# Altium schematic sheet H3_CPU_02.SchDoc
size A3
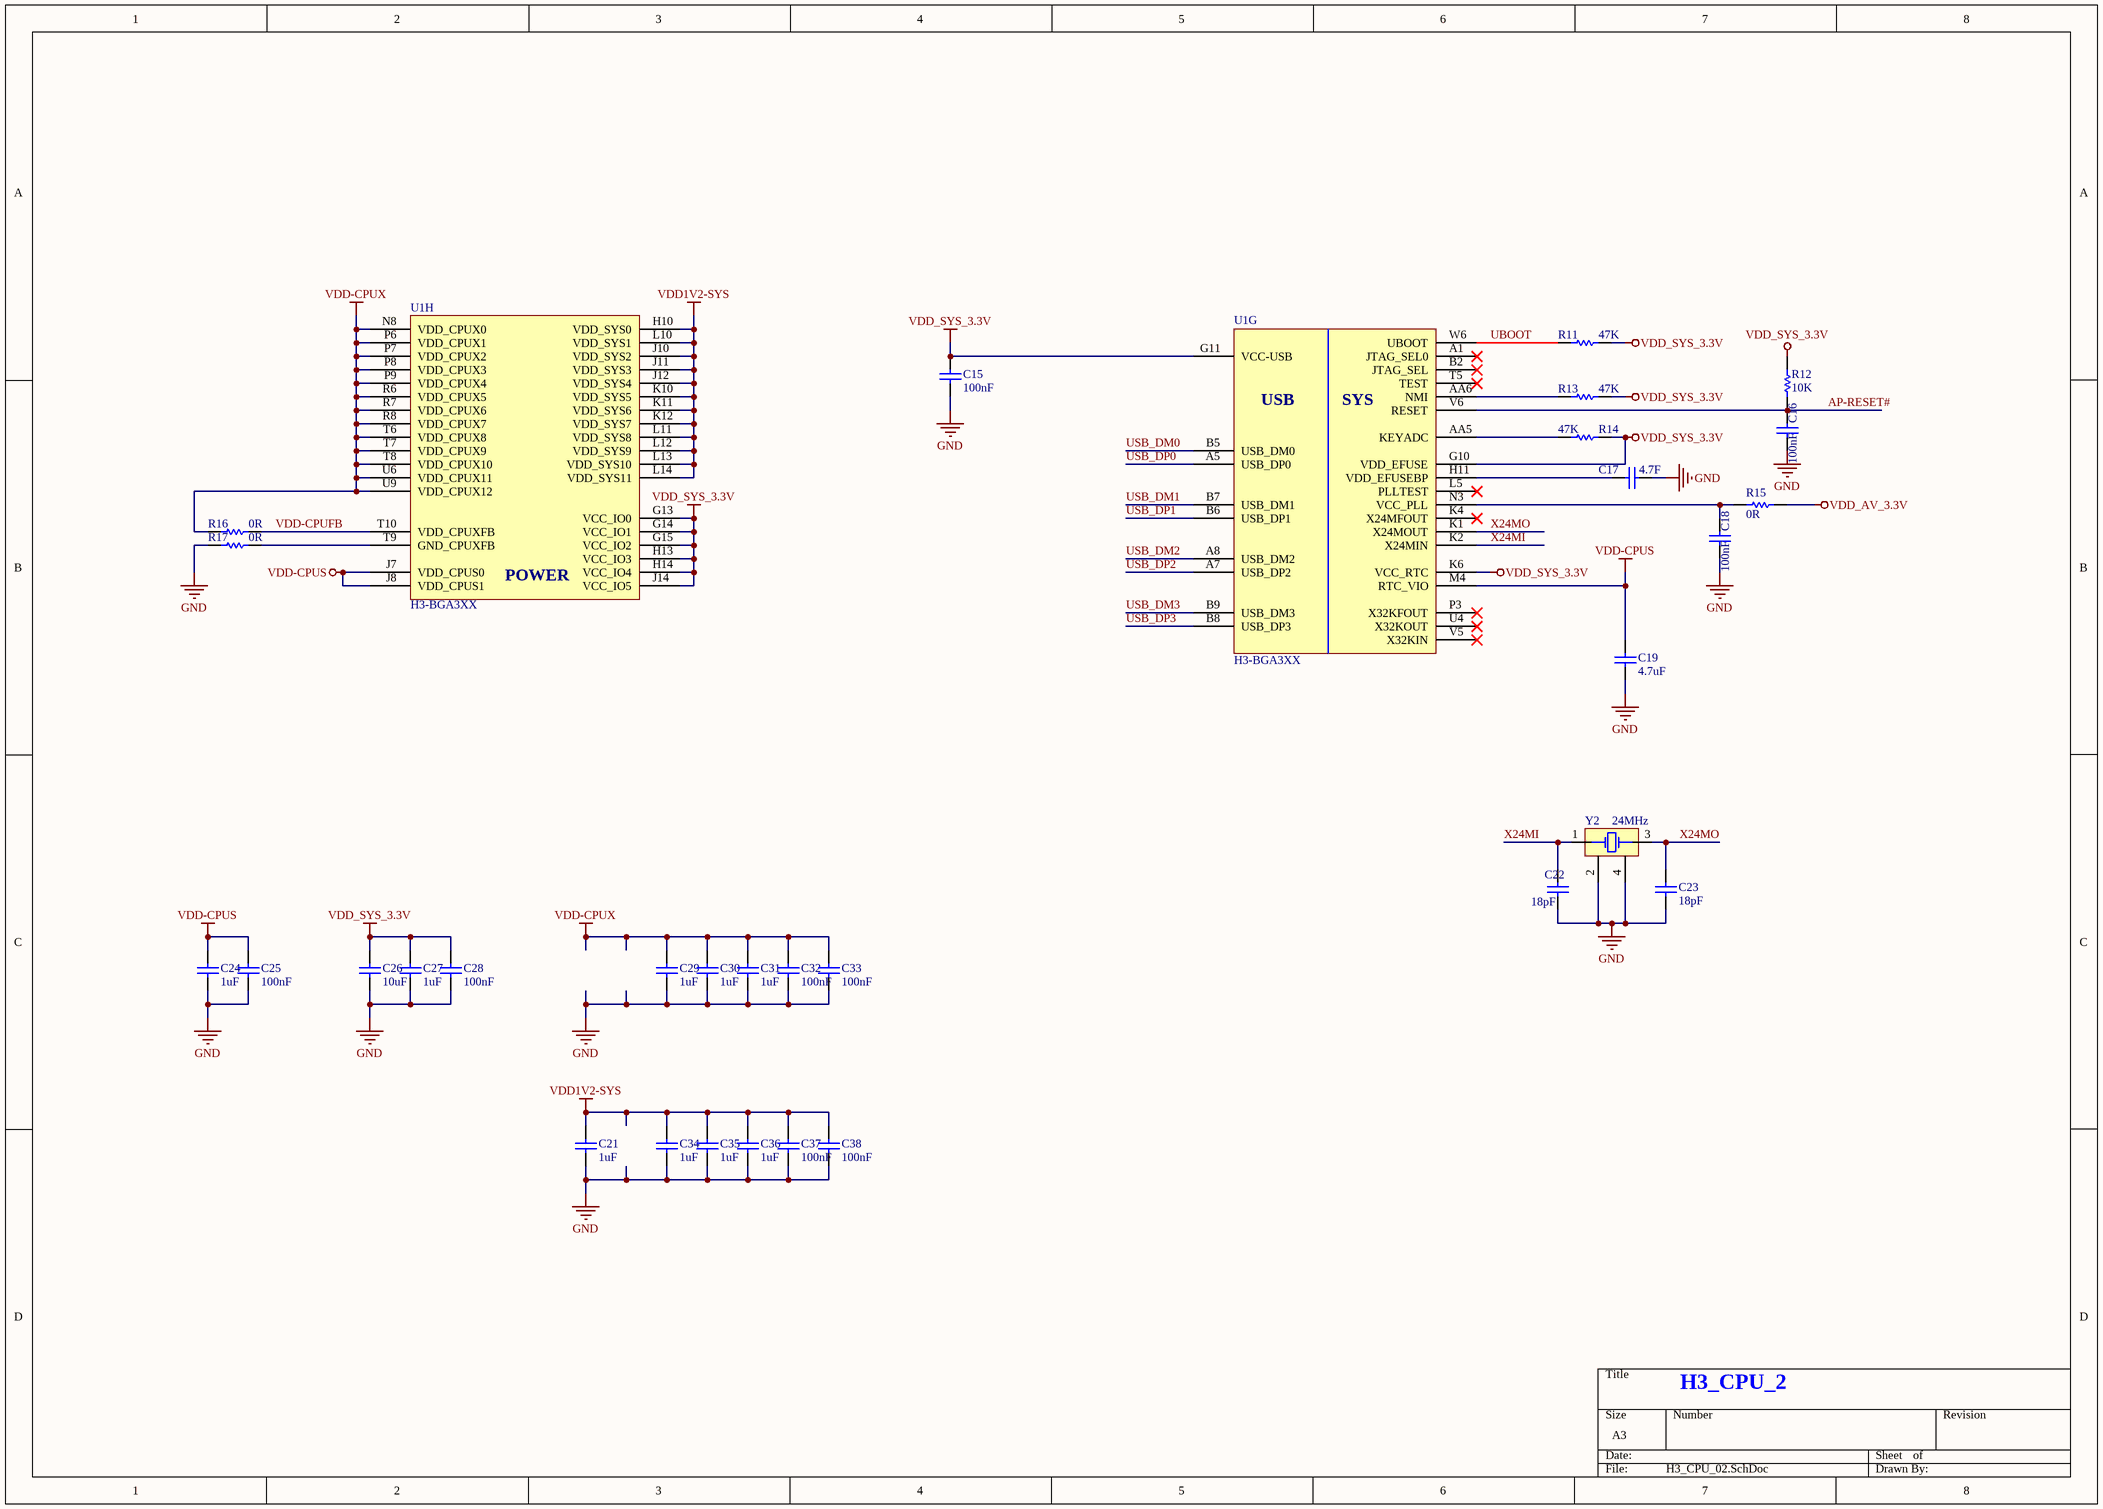
[diagram p0: H3_CPU_02.SchDoc]

## Parts
C15  100nF  [C0402]
C16  100nF  [C0402]
C17  4.7F  [C0402]
C18  100nF  [C0402]
C19  4.7uF  [C0402]
C21  1uF  [C0402]
C22  18pF  [C0402]
C23  18pF  [C0402]
C24  1uF  [C0402]
C25  100nF  [C0402]
C26  10uF  [C0603]
C27  1uF  [C0402]
C28  100nF  [C0402]
C29  1uF  [C0402]
C30  1uF  [C0402]
C31  1uF  [C0402]
C32  100nF  [C0402]
C33  100nF  [C0402]
C34  1uF  [C0402]
C35  1uF  [C0402]
C36  1uF  [C0402]
C37  100nF  [C0402]
C38  100nF  [C0402]
R11  47K  [R0402]
R12  10K  [R0402]
R13  47K  [R0402]
R14  47K  [R0402]
R15  0R  [R0402]
R16  0R  [R0402]
R17  0R  [R0402]
U1  H3-BGA3XX  [BGA-H3-347]  (parts G,H of 9)
Y2  24MHz  [X-TSX-3225]

## Nets
GND: C15.1 C16.1 C17.1 C18.1 C19.1 C21.1 C22.1 C23.1 C24.1 C25.1 C26.1 C27.1 C28.1 C29.1 C30.1 C31.1 C32.1 C33.1 C34.1 C35.1 C36.1 C37.1 C38.1 R17.1 Y2.2 Y2.4
VDD1V2-SYS: C21.2 C34.2 C35.2 C36.2 C37.2 C38.2 U1.H10(VDD_SYS0) U1.J10(VDD_SYS2) U1.J11(VDD_SYS3) U1.J12(VDD_SYS4) U1.K10(VDD_SYS5) U1.K11(VDD_SYS6) U1.K12(VDD_SYS7) U1.L10(VDD_SYS1) U1.L11(VDD_SYS8) U1.L12(VDD_SYS9) U1.L13(VDD_SYS10) U1.L14(VDD_SYS11)
VDD-CPUS: C19.2 C24.2 C25.2 U1.J7(VDD_CPUS0) U1.J8(VDD_CPUS1) U1.M4(RTC_VIO)
VDD-CPUX: C29.2 C30.2 C31.2 C32.2 C33.2 R16.2 U1.N8(VDD_CPUX0) U1.P6(VDD_CPUX1) U1.P7(VDD_CPUX2) U1.P8(VDD_CPUX3) U1.P9(VDD_CPUX4) U1.R6(VDD_CPUX5) U1.R7(VDD_CPUX6) U1.R8(VDD_CPUX7) U1.T6(VDD_CPUX8) U1.T7(VDD_CPUX9) U1.T8(VDD_CPUX10) U1.U6(VDD_CPUX11) U1.U9(VDD_CPUX12)
VDD_AV_3.3V: R15.1
VDD_SYS_3.3V: C15.2 C26.2 C27.2 C28.2 R11.1 R12.2 R13.2 R14.2 U1.G10(VDD_EFUSE) U1.G11(VCC-USB) U1.G13(VCC_IO0) U1.G14(VCC_IO1) U1.G15(VCC_IO2) U1.H13(VCC_IO3) U1.H14(VCC_IO4) U1.J14(VCC_IO5) U1.K6(VCC_RTC)
AP-RESET#: C16.2 R12.1 U1.V6(RESET)
UBOOT: R11.2 U1.W6(UBOOT)
USB_DM0: U1.B5(USB_DM0)
USB_DM1: U1.B7(USB_DM1)
USB_DM2: U1.A8(USB_DM2)
USB_DM3: U1.B9(USB_DM3)
USB_DP0: U1.A5(USB_DP0)
USB_DP1: U1.B6(USB_DP1)
USB_DP2: U1.A7(USB_DP2)
USB_DP3: U1.B8(USB_DP3)
VDD-CPUFB: R16.1 U1.T10(VDD_CPUXFB)
X24MI: C22.2 U1.K2(X24MIN) Y2.1
X24MO: C23.2 U1.K1(X24MOUT) Y2.3
NetC17_2: C17.2 U1.H11(VDD_EFUSEBP)
NetC18_2: C18.2 R15.2 U1.N3(VCC_PLL)
NetR13_1: R13.1 U1.AA6(NMI)
NetR14_1: R14.1 U1.AA5(KEYADC)
NetR17_2: R17.2 U1.T9(GND_CPUXFB)

Not connected (* = marked no-connect by the designer): U1 A1(JTAG_SEL0)* B2(JTAG_SEL)* K4(X24MFOUT)* L5(PLLTEST)* P3(X32KFOUT)* T5(TEST)* U4(X32KOUT)* V5(X32KIN)*

## Notes on the sheet
- H3_CPU_2
- (in symbol H3-BGA3XX, part G) USB; SYS
- (in symbol H3-BGA3XX, part H) POWER

## Library data of the parts
C15-C19 C21-C25 C27-C38 = C0402: 电容; Published: 8-Jun-2000; LatestRevisionDate: 17-Jul-2002; LatestRevisionNote: Re-released for DXP Platform.; PackageReference: RAD-0.3; Publisher: Altium Limited; PackageDescription: Radial Cap, Thru-Hole; 2 Leads; 0.3 in Pin Spacing; UnitPrice: 0.02
C26 = C0603: 电容; Published: 8-Jun-2000; LatestRevisionDate: 17-Jul-2002; LatestRevisionNote: Re-released for DXP Platform.; PackageReference: RAD-0.3; Publisher: Altium Limited; PackageDescription: Radial Cap, Thru-Hole; 2 Leads; 0.3 in Pin Spacing; UnitPrice: 0.02
R11-R17 = RES0402: 电阻; Published: 8-Jun-2000; LatestRevisionDate: 17-Jul-2002; LatestRevisionNote: Re-released for DXP Platform.; PackageReference: AXIAL-0.3; Publisher: Altium Limited; PackageDescription: Axial Device, Thru-Hole; 2 Leads; 0.3 in Pin Spacing
Y2 = XTAL_1: Crystal Oscillator; Published: 8-Jun-2000; LatestRevisionDate: 17-Jul-2002; LatestRevisionNote: Re-released for DXP Platform.; Publisher: Altium Limited